# EAGLE design nixie_clock (EAGLE 7.2.0)
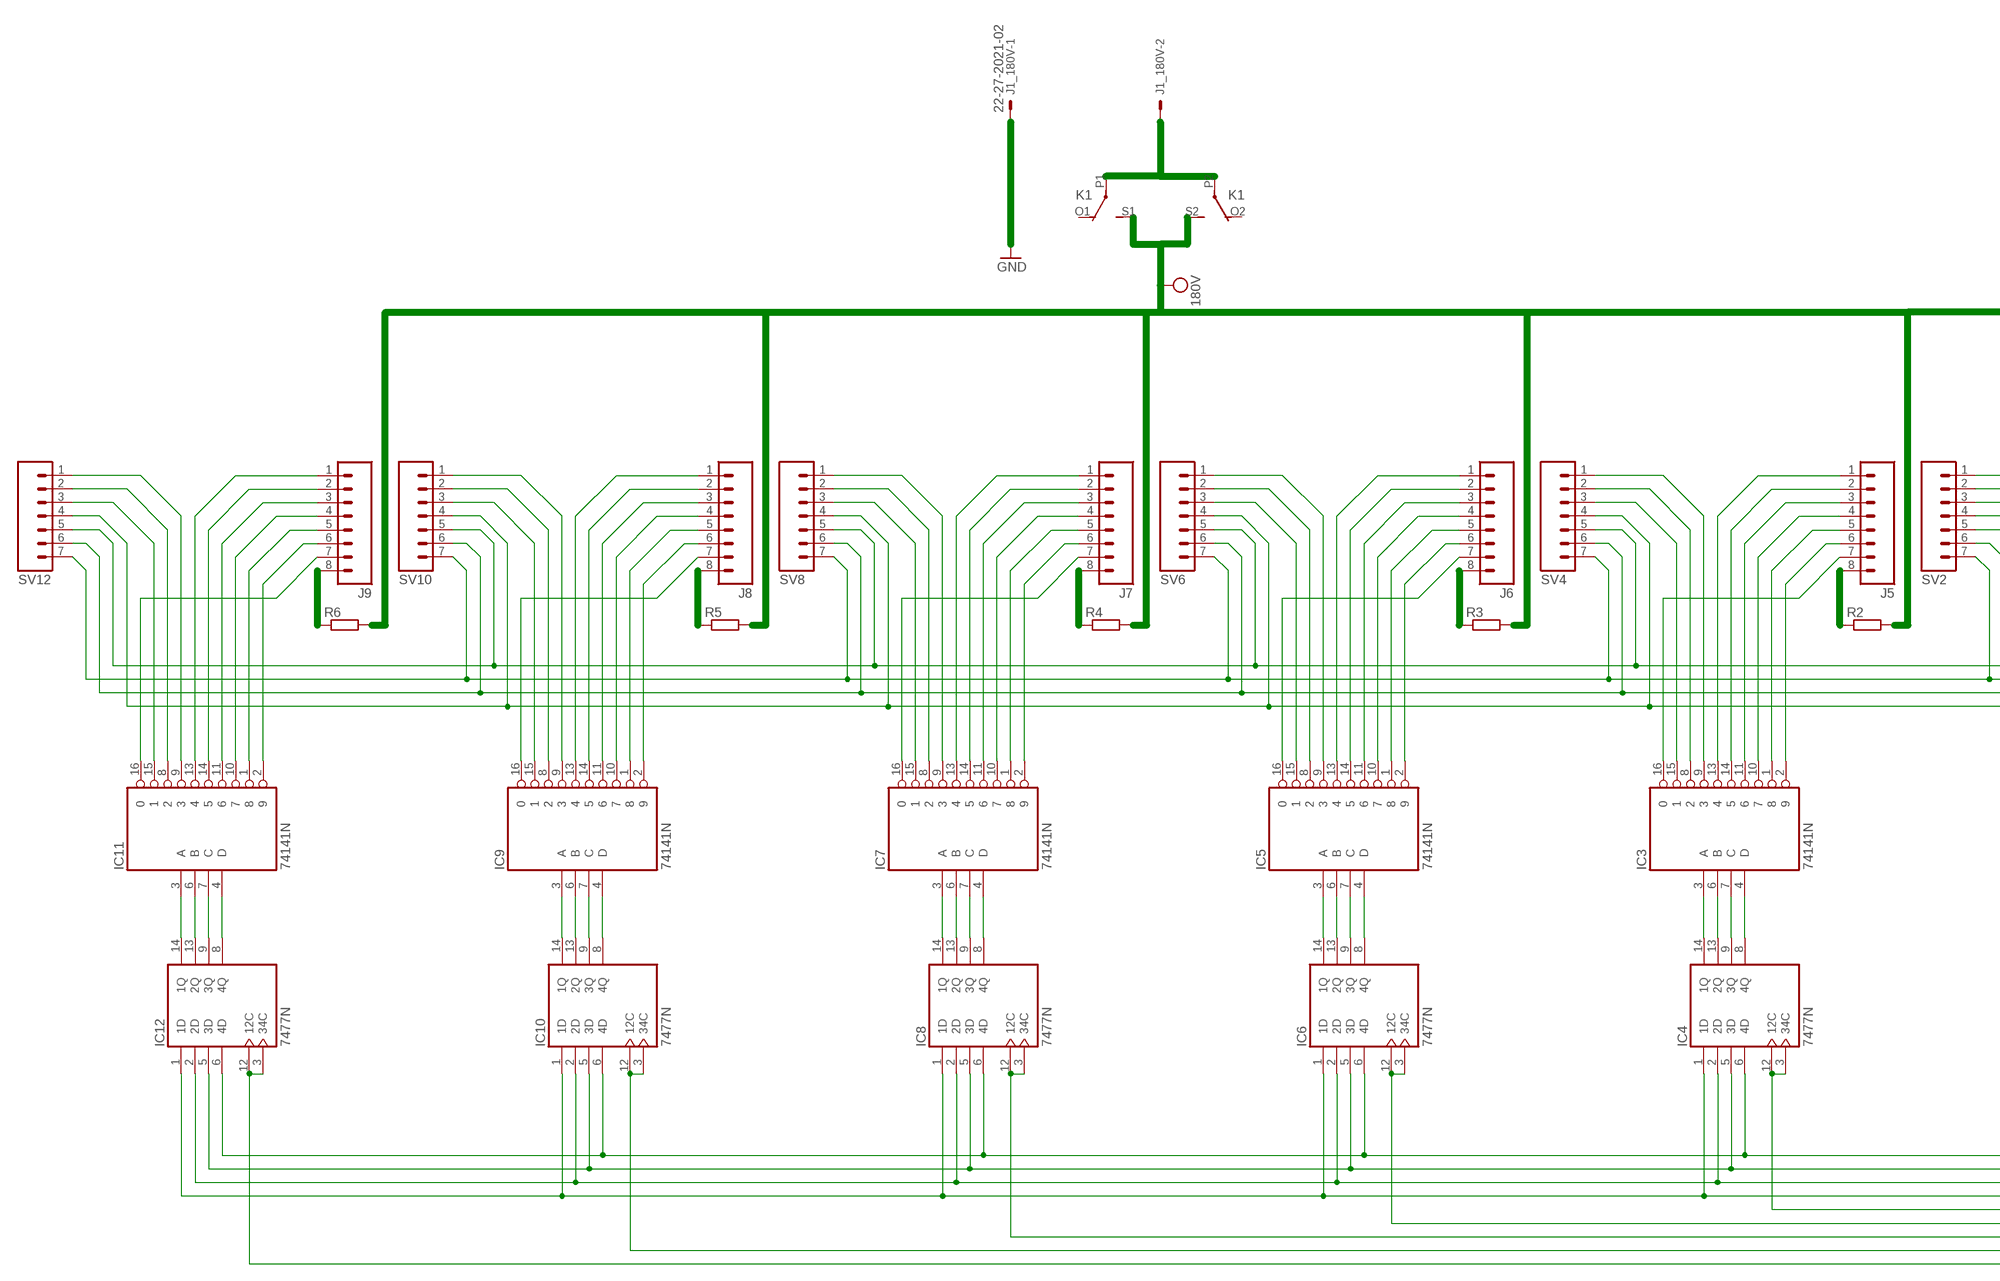
[diagram p0: schematic, sheet 1, part 1 of 3]
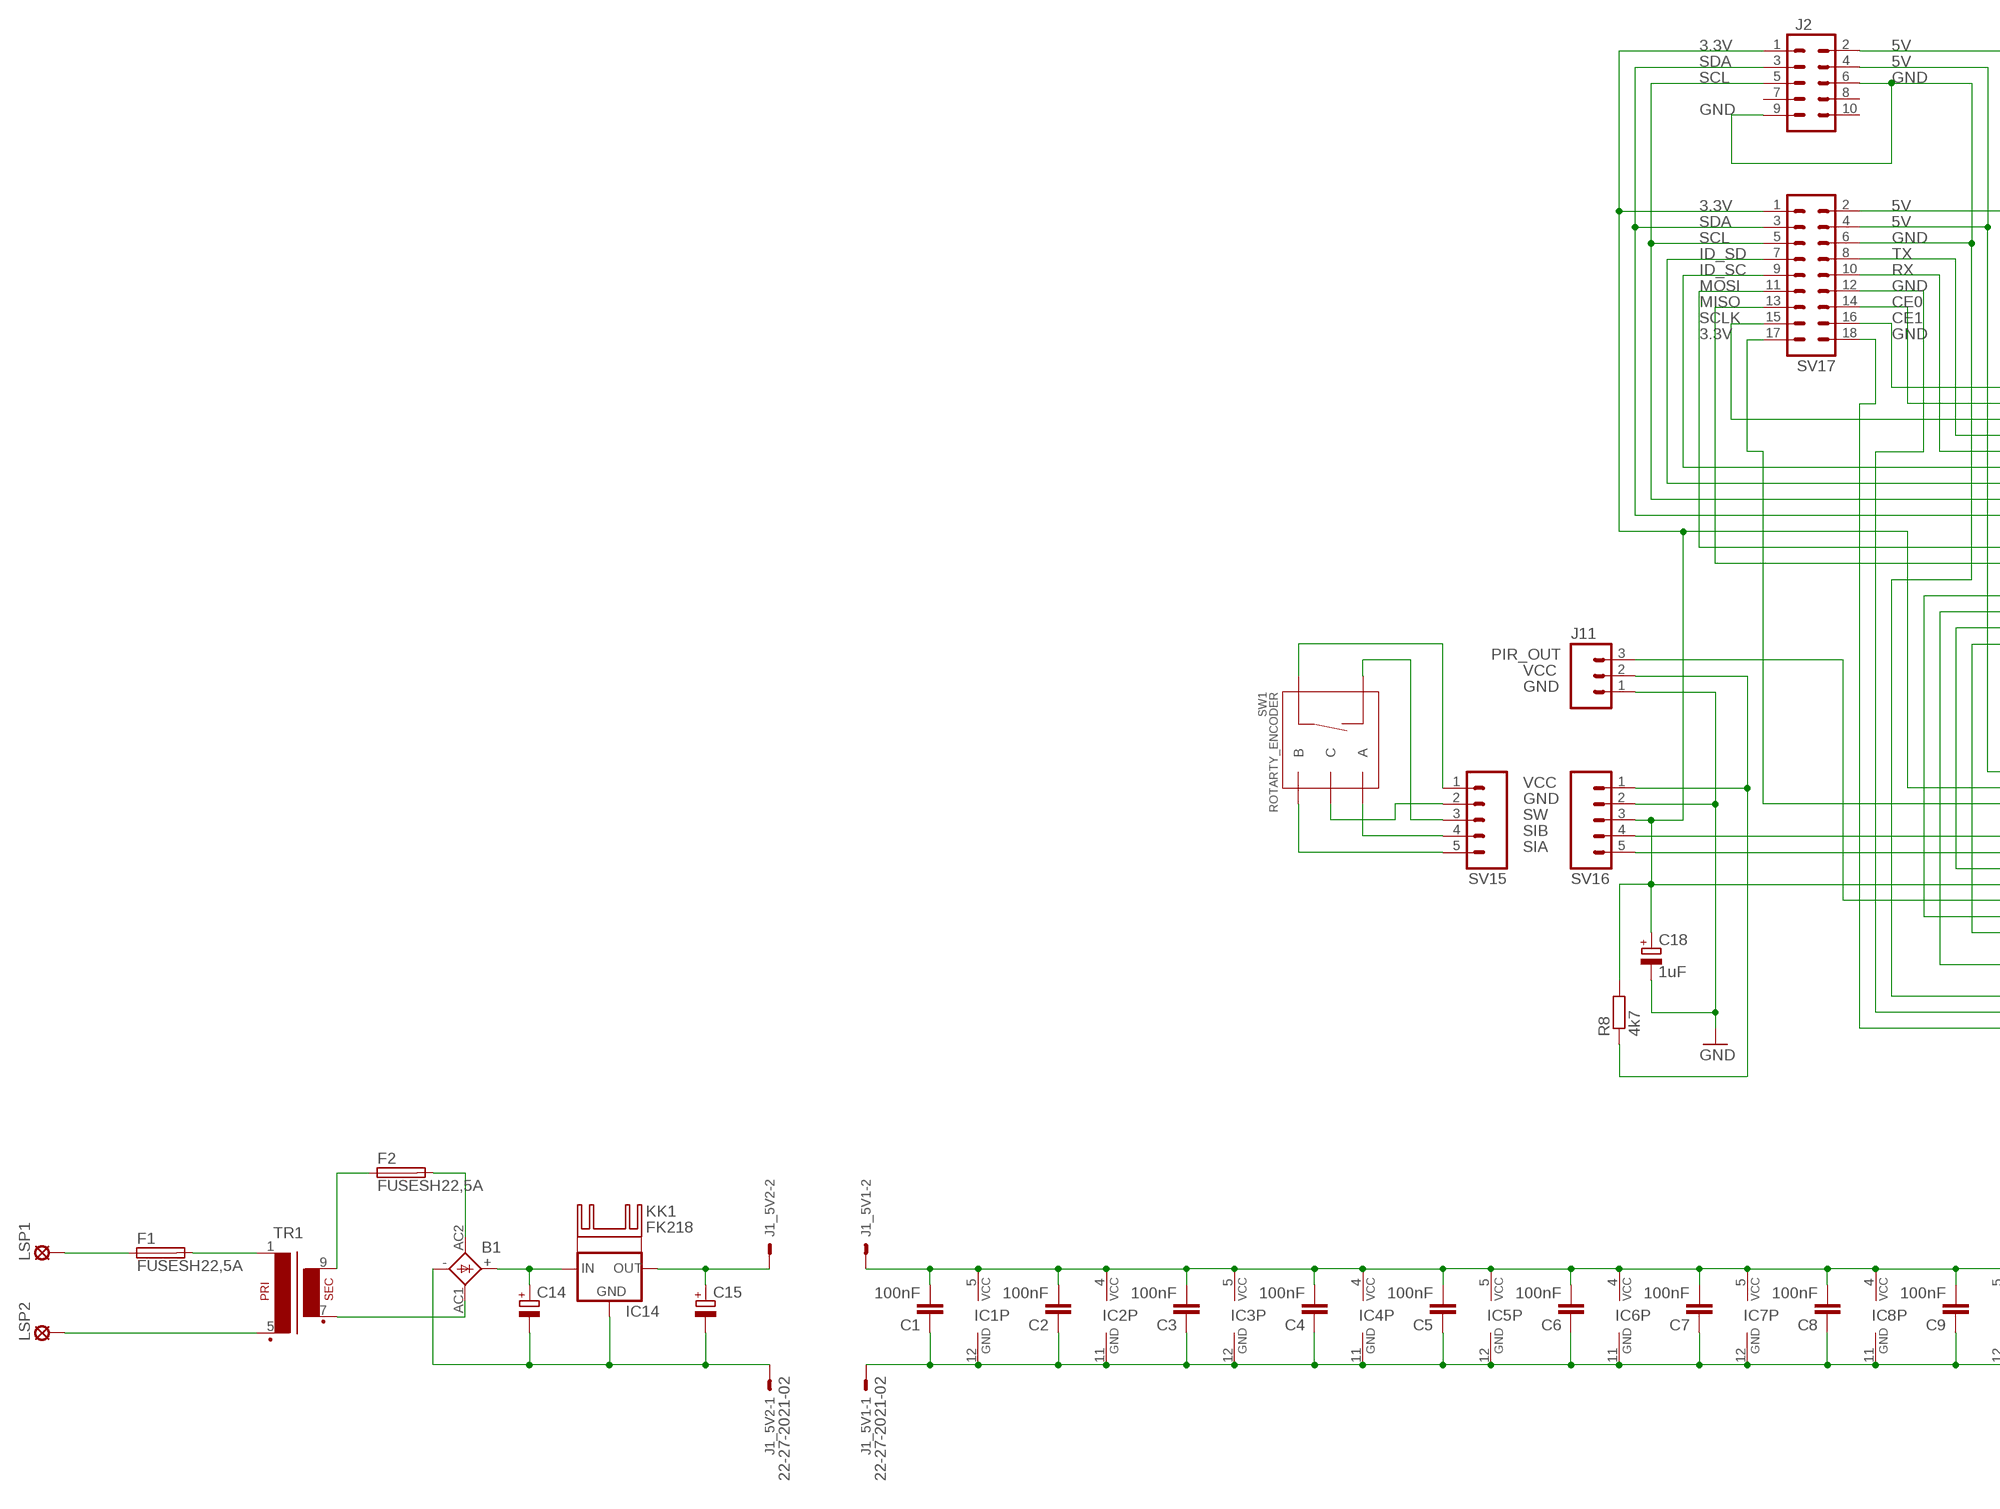
[diagram p1: schematic, sheet 1, part 2 of 3]
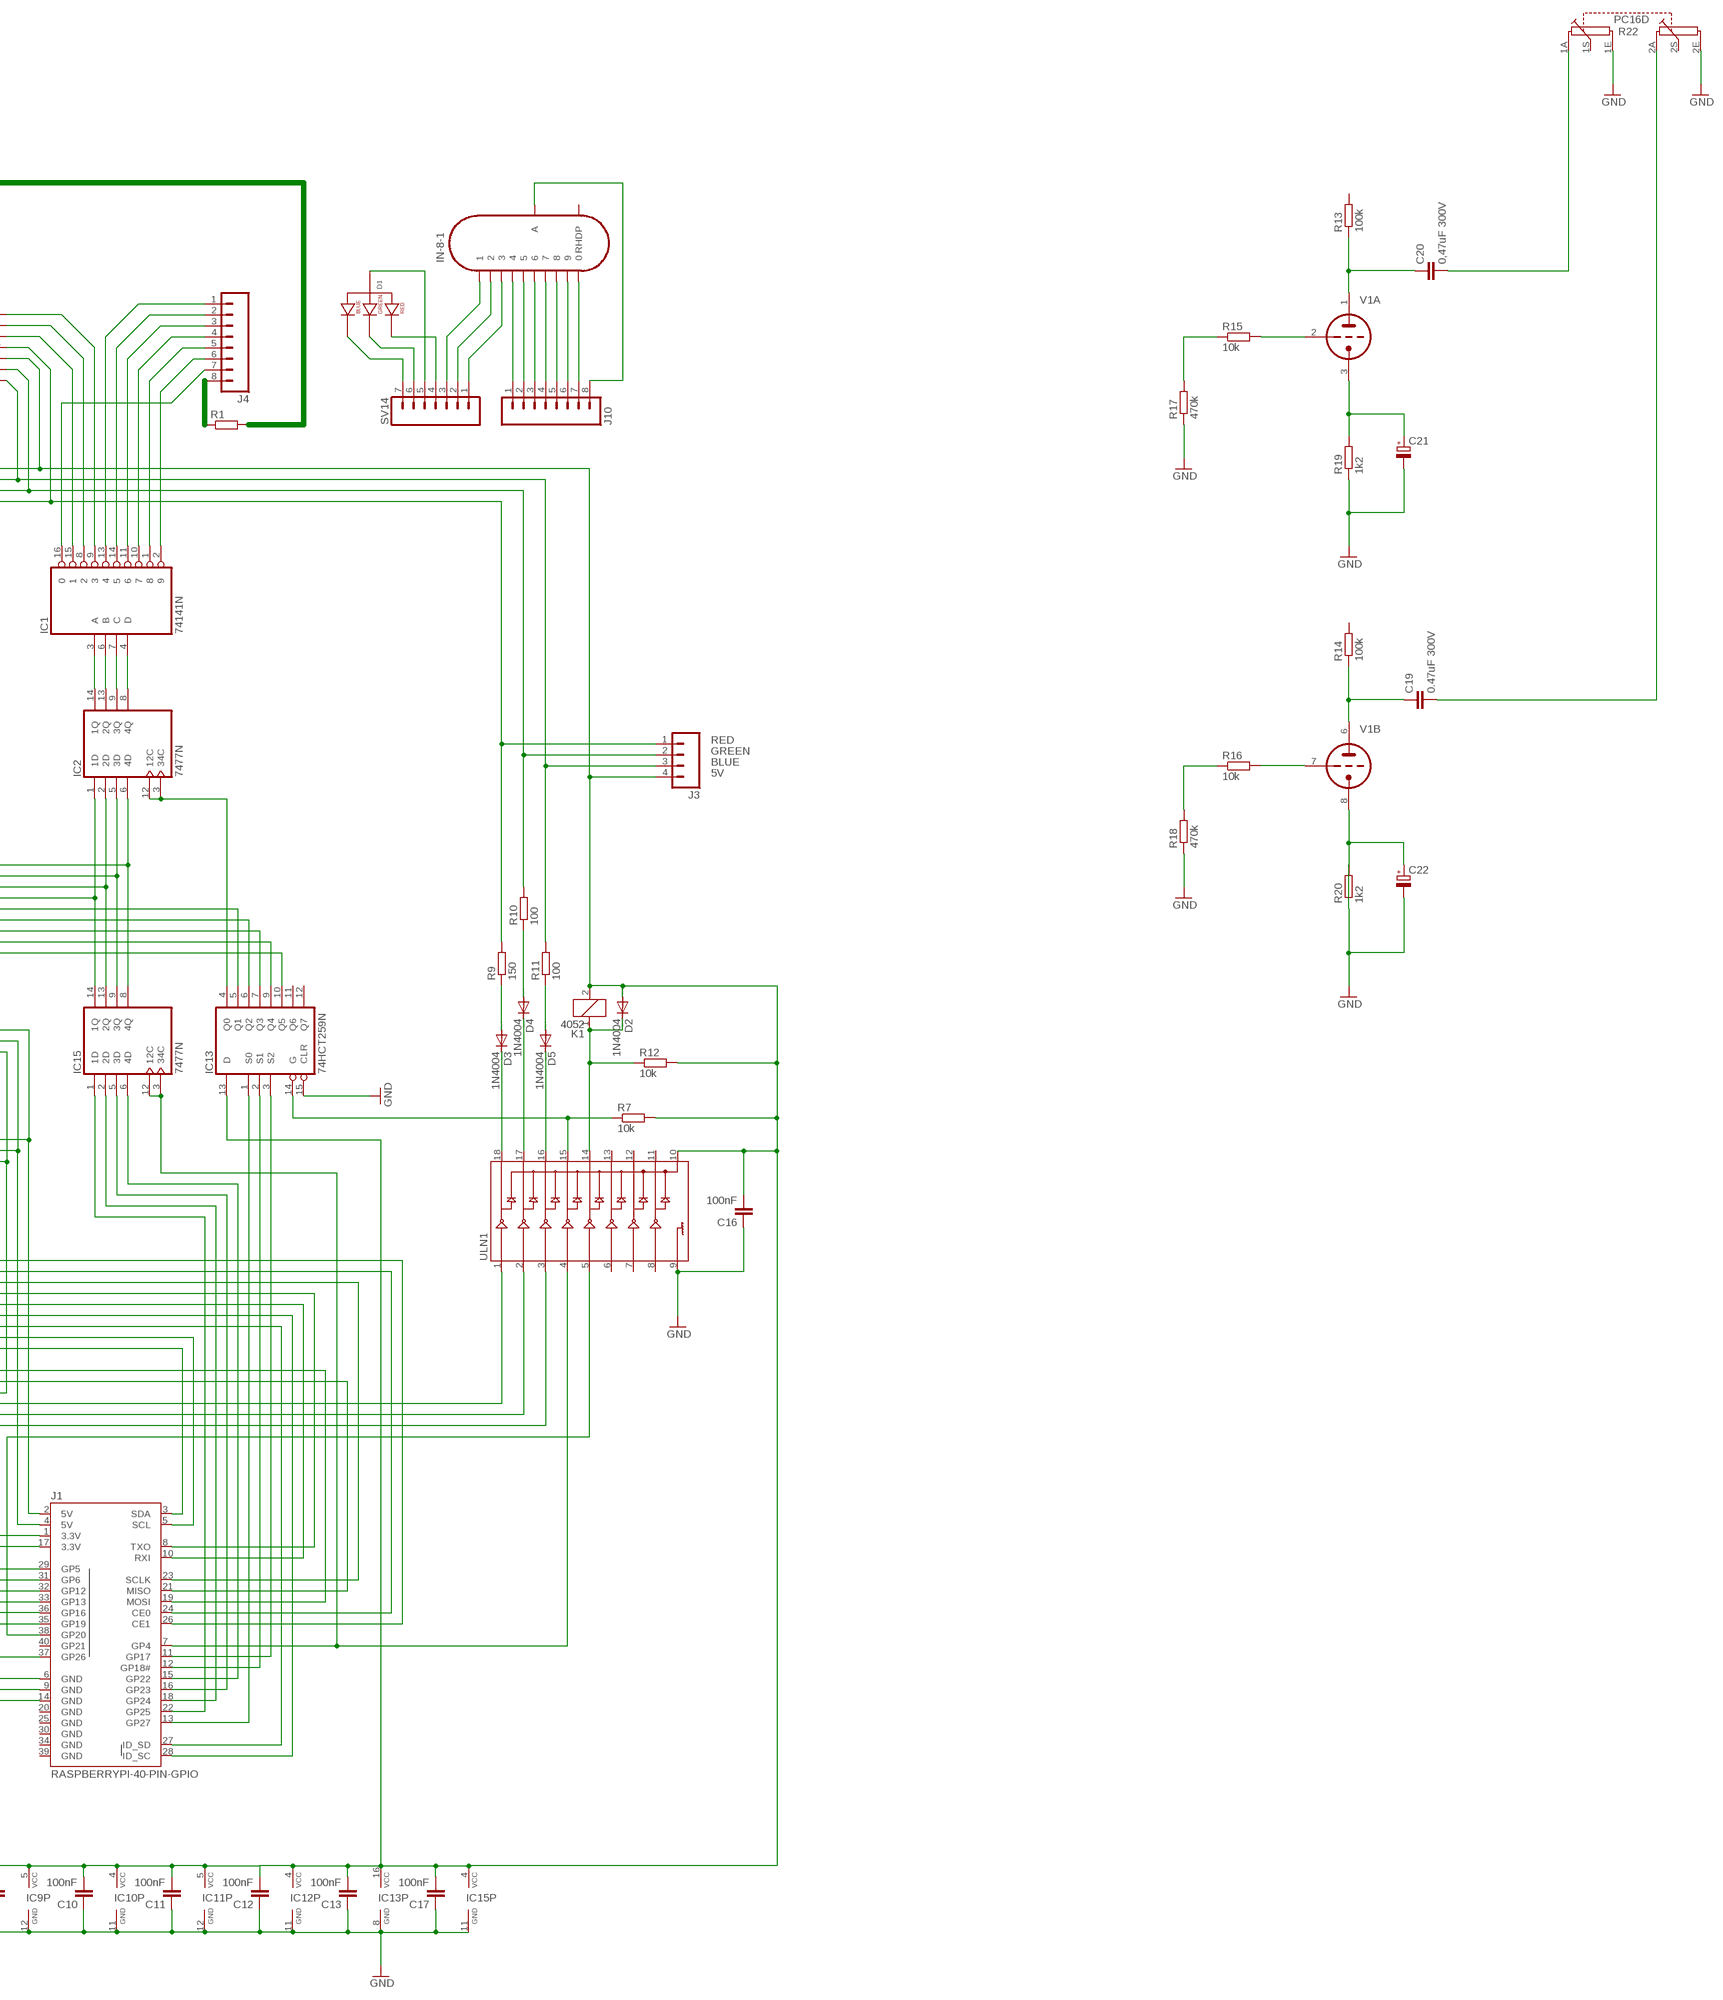
[diagram p2: schematic, sheet 1, part 3 of 3]

## Parts
B1  FBP1,5  [FBP1,5]
C1  100nF  C-EU025-024X044  [C025-024X044]
C2  100nF  C-EU025-024X044  [C025-024X044]
C3  100nF  C-EU025-024X044  [C025-024X044]
C4  100nF  C-EU025-024X044  [C025-024X044]
C5  100nF  C-EU025-024X044  [C025-024X044]
C6  100nF  C-EU025-024X044  [C025-024X044]
C7  100nF  C-EU025-024X044  [C025-024X044]
C8  100nF  C-EU025-024X044  [C025-024X044]
C9  100nF  C-EU025-024X044  [C025-024X044]
C10  100nF  C-EU025-024X044  [C025-024X044]
C11  100nF  C-EU025-024X044  [C025-024X044]
C12  100nF  C-EU025-024X044  [C025-024X044]
C13  100nF  C-EU025-024X044  [C025-024X044]
C14  CPOL-EUE5-10.5  [E5-10,5]
C15  CPOL-EUE3.5-10  [E3,5-10]
C16  100nF  C-EU025-024X044  [C025-024X044]
C17  100nF  C-EU025-024X044  [C025-024X044]
C18  1uF  CPOL-EUE2.5-5  [E2,5-5]
C19  0.47uF 300V  C-EU275-154X316  [C275-154X316]
C20  0,47uF 300V  C-EU275-154X316  [C275-154X316]
C21  CPOL-EUE2.5-5  [E2,5-5]
C22  CPOL-EUE2.5-5  [E2,5-5]
D1  LED-RGB-CA-THRUCLEAR  [LED-RGB-THRU]
D2  1N4004  [DO41-10]
D3  1N4004  [DO41-10]
D4  1N4004  [DO41-10]
D5  1N4004  [DO41-10]
F1  FUSESH22,5A  [SH22,5A]
F2  FUSESH22,5A  [SH22,5A]
IC1  74141N  [DIL16]
IC2  7477N  [DIL14]
IC3  74141N  [DIL16]
IC4  7477N  [DIL14]
IC5  74141N  [DIL16]
IC6  7477N  [DIL14]
IC7  74141N  [DIL16]
IC8  7477N  [DIL14]
IC9  74141N  [DIL16]
IC10  7477N  [DIL14]
IC11  74141N  [DIL16]
IC12  7477N  [DIL14]
IC13  74HCT259N  [DIL16]
IC14  78XXS  [78XXS]
IC15  7477N  [DIL14]
IN-8-1  IN-8-2  [IN-8-2]
J1  RASPBERRYPI-40-PIN-GPIO  [2X20-SHROUDED]
J1_5V1  22-27-2021-02  [6410-02]
J1_5V2  22-27-2021-02  [6410-02]
J1_180V  22-27-2021-02  [6410-02]
J2  M05X2PTH  [AVR_ICSP]
J3  M04  [04P]
J4  M08  [1X08_ROUND]
J5  M08  [1X08_ROUND]
J6  M08  [1X08_ROUND]
J7  M08  [1X08_ROUND]
J8  M08  [1X08_ROUND]
J9  M08  [1X08_ROUND]
J10  M08  [1X08_ROUND]
J11  M03  [03P]
K1  4052  [F4052]
KK1  FK218  [FK218]
LSP1  LSP10  [LSP10]
LSP2  LSP10  [LSP10]
R1  R-EU_0207/15  [0207/15]
R2  R-EU_0207/15  [0207/15]
R3  R-EU_0207/15  [0207/15]
R4  R-EU_0207/15  [0207/15]
R5  R-EU_0207/15  [0207/15]
R6  R-EU_0207/15  [0207/15]
R7  10k  R-EU_0204/7  [0204/7]
R8  4k7  R-EU_0204/7  [0204/7]
R9  150  R-EU_0204/7  [0204/7]
R10  100  R-EU_0204/7  [0204/7]
R11  100  R-EU_0204/7  [0204/7]
R12  10k  R-EU_0204/7  [0204/7]
R13  100k  R-EU_0309/10  [0309/10]
R14  100k  R-EU_0309/10  [0309/10]
R15  10k  R-EU_0309/10  [0309/10]
R16  10k  R-EU_0309/10  [0309/10]
R17  470k  R-EU_0309/10  [0309/10]
R18  470k  R-EU_0309/10  [0309/10]
R19  1k2  R-EU_0309/10  [0309/10]
R20  1k2  R-EU_0309/10  [0309/10]
R22  PC16D  [PC16D]
SV2  M07  [1X07]
SV4  M07  [1X07]
SV6  M07  [1X07]
SV8  M07  [1X07]
SV10  M07  [1X07]
SV12  M07  [1X07]
SV14  M07  [1X07]
SV15  M05PTH  [1X05]
SV16  M05  [05P]
SV17  MA09-2  [MA09-2]
SW1  ROTARTY_ENCODER  [ROTARY_ENC_PLAIN]
TR1  EI42-1  [EI42-1]
ULN1  ULN2803DIP  [DIL18]
V1  ECC82-P  [NOVAL]

## Nets
5V [180V]: C1.2 C2.2 C3.2 C4.2 C5.2 C6.2 C7.2 C8.2 C9.2 C10.2 C11.2 C12.2 C13.2 C16.2 C17.2 D2.A IC1.5(VCC) IC2.4(VCC) IC3.5(VCC) IC4.4(VCC) IC5.5(VCC) IC6.4(VCC) IC7.5(VCC) IC8.4(VCC) IC9.5(VCC) IC10.4(VCC) IC11.5(VCC) IC12.4(VCC) IC13.13(D) IC13.16(VCC) IC15.4(VCC) J1_5V1.2 J3.4 K1.2 R7.2 R12.2 SV2.5 SV4.5 SV6.5 SV8.5 SV10.5 SV12.5 ULN1.10
BLUE: J3.3 R11.2 SV2.7 SV4.7 SV6.7 SV8.7 SV10.7 SV12.7
GND [180V]: C1.1 C2.1 C3.1 C4.1 C5.1 C6.1 C7.1 C8.1 C9.1 C10.1 C11.1 C12.1 C13.1 C16.1 C17.1 C18.- C21.- IC1.12(GND) IC2.11(GND) IC3.12(GND) IC4.11(GND) IC5.12(GND) IC6.11(GND) IC7.12(GND) IC8.11(GND) IC9.12(GND) IC10.11(GND) IC11.12(GND) IC12.11(GND) IC13.8(GND) IC13.15(CLR) IC15.11(GND) J1_5V1.1 J1_180V.1 J11.1 R17.1 R18.1 R19.1 R22.1E R22.2E SV16.2 ULN1.9
GREEN: J3.2 R10.2 SV2.6 SV4.6 SV6.6 SV8.6 SV10.6 SV12.6
N$1: IN-8-1.4 J10.1
N$2: IC1.3(A) IC2.14(1Q)
N$3: IC1.6(B) IC2.13(2Q)
N$4: IC1.7(C) IC2.9(3Q)
N$5: IC1.4(D) IC2.8(4Q)
N$6: IN-8-1.5 J10.2
N$7: IN-8-1.6 J10.3
N$8: IN-8-1.7 J10.4
N$9: IN-8-1.8 J10.5
N$10: IN-8-1.9 J10.6
N$11: IN-8-1.0 J10.7
N$12: IN-8-1.3 SV14.1
N$13: IN-8-1.2 SV14.2
N$14: IN-8-1.1 SV14.3
N$15: D1.1(RED_CATHODE) SV14.4
N$16: IC2.3(34C) IC2.12(12C) IC13.4(Q0)
N$17: IC2.6(4D) IC4.6(4D) IC6.6(4D) IC8.6(4D) IC10.6(4D) IC12.6(4D) IC15.8(4Q)
N$18: IC1.13 J4.1
N$19: IC1.14 J4.2
N$20: D1.4(BLUE_CATHODE) SV14.7
N$21: D1.2(ANODE) SV14.5
N$22: D1.3(GREEN_CATHODE) SV14.6
N$23: IC1.11 J4.3
N$24: IC1.10 J4.4
N$25: IC1.1 J4.5
N$26: IC1.2 J4.6
N$27: IC1.9 SV2.1
N$28: IC1.8 SV2.2
N$29: IC3.3(A) IC4.14(1Q)
N$30: IC3.6(B) IC4.13(2Q)
N$31: IC3.7(C) IC4.9(3Q)
N$32: IC3.4(D) IC4.8(4Q)
N$33: IC4.3(34C) IC4.12(12C) IC13.5(Q1)
N$34: IC1.15 SV2.3
N$35: IC1.16 J4.7
N$36: IC3.13 J5.1
N$37: IC3.14 J5.2
N$38: IC3.11 J5.3
N$39: IC3.10 J5.4
N$40: IC3.1 J5.5
N$41: IC3.2 J5.6
N$42: IC3.16 J5.7
N$43: IC3.9 SV4.1
N$44: IC5.3(A) IC6.14(1Q)
N$45: IC5.6(B) IC6.13(2Q)
N$46: IC5.7(C) IC6.9(3Q)
N$47: IC5.4(D) IC6.8(4Q)
N$48: IC6.3(34C) IC6.12(12C) IC13.6(Q2)
N$49: IC3.8 SV4.2
N$50: IC3.15 SV4.3
N$51: IC5.13 J6.1
N$52: IC5.14 J6.2
N$53: IC5.11 J6.3
N$54: IC5.10 J6.4
N$55: IC5.1 J6.5
N$56: IC5.2 J6.6
N$57: IC5.16 J6.7
N$58: IC5.9 SV6.1
N$59: IC7.3(A) IC8.14(1Q)
N$60: IC7.6(B) IC8.13(2Q)
N$61: IC7.7(C) IC8.9(3Q)
N$62: IC7.4(D) IC8.8(4Q)
N$63: IC8.3(34C) IC8.12(12C) IC13.7(Q3)
N$64: IC5.8 SV6.2
N$65: IC5.15 SV6.3
N$66: IC7.13 J7.1
N$67: IC7.14 J7.2
N$68: IC7.11 J7.3
N$69: IC7.10 J7.4
N$70: IC7.1 J7.5
N$71: IC7.2 J7.6
N$72: IC7.16 J7.7
N$73: IC7.9 SV8.1
N$74: IC9.3(A) IC10.14(1Q)
N$75: IC9.6(B) IC10.13(2Q)
N$76: IC9.7(C) IC10.9(3Q)
N$77: IC9.4(D) IC10.8(4Q)
N$78: IC10.3(34C) IC10.12(12C) IC13.9(Q4)
N$79: IC7.8 SV8.2
N$80: IC7.15 SV8.3
N$81: IC9.13 J8.1
N$82: IC9.14 J8.2
N$83: IC9.11 J8.3
N$84: IC9.10 J8.4
N$85: IC9.1 J8.5
N$86: IC9.2 J8.6
N$87: IC11.13 J9.1
N$88: IC11.14 J9.2
N$89: IC11.3(A) IC12.14(1Q)
N$90: IC11.6(B) IC12.13(2Q)
N$91: IC11.7(C) IC12.9(3Q)
N$92: IC11.4(D) IC12.8(4Q)
N$93: IC12.3(34C) IC12.12(12C) IC13.10(Q5)
N$94: IC2.5(3D) IC4.5(3D) IC6.5(3D) IC8.5(3D) IC10.5(3D) IC12.5(3D) IC15.9(3Q)
N$95: IC2.2(2D) IC4.2(2D) IC6.2(2D) IC8.2(2D) IC10.2(2D) IC12.2(2D) IC15.13(2Q)
N$96: IC2.1(1D) IC4.1(1D) IC6.1(1D) IC8.1(1D) IC10.1(1D) IC12.1(1D) IC15.14(1Q)
N$97: IC13.1(S0) J1.13(GP27)
N$98: IC13.2(S1) J1.12(GP18#)
N$99: IC13.3(S2) J1.11(GP17)
N$100: IC9.16 J8.7
N$101: IC9.9 SV10.1
N$102: IC9.8 SV10.2
N$103: IC9.15 SV10.3
N$104: IN-8-1.A J10.8
N$105: IC11.11 J9.3
N$106: IC11.10 J9.4
N$107: IC11.1 J9.5
N$108: B1.+ C14.+ IC14.IN
N$109: IC11.2 J9.6
N$110: IC11.16 J9.7
N$111: IC11.9 SV12.1
N$112: IC11.8 SV12.2
N$113: IC11.15 SV12.3
N$114 [180V]: J8.8 R5.1
N$115 [180V]: J9.8 R6.1
N$116: D4.C ULN1.17
N$117: F1.1 LSP1.MP
N$118: F1.2 TR1.1
N$119: LSP2.MP TR1.5(P2)
N$120: F2.1 TR1.9(S4)
N$121: B1.AC2(AC1) F2.2
N$122: B1.AC1(AC2) TR1.7(S3)
N$123: C15.+ IC14.OUT J1_5V2.2
N$124: J1.35(GP19) ULN1.1
N$125 [180V]: B1.- C14.- C15.- IC14.GND J1_5V2.1
N$126 [180V]: J1_180V.2 K1.P1(2:P) K1.P2(3:P)
N$127: J1.37(GP26) ULN1.2
N$128: SV15.4 SW1.A
N$129: J1.32(GP12) ULN1.3
N$130: C18.+ J1.1(3.3V) J1.33(GP13) J2.1 R8.2 SV16.3 SV17.1
N$131: SV15.3 SW1.SW-
N$132: SV15.1 SW1.SW+
N$133: SV15.2 SW1.C
N$134: SV15.5 SW1.B
N$135: D3.C ULN1.18
N$136: D5.C ULN1.16
N$137: J1.31(GP6) SV16.5
N$138: J1.29(GP5) SV16.4
N$139: D3.A R9.1
N$140: IC13.14(G) R7.1 ULN1.15
N$141: IC15.1(1D) J1.22(GP25)
N$142: IC15.2(2D) J1.18(GP24)
N$143: IC15.5(3D) J1.16(GP23)
N$144: IC15.6(4D) J1.15(GP22)
N$146: IC15.3(34C) IC15.12(12C) J1.7(GP4) ULN1.4
N$147: D4.A R10.1
N$148: D5.A R11.1
N$149: J1.38(GP20) ULN1.5
N$150 [180V]: J7.8 R4.1
N$151: D2.C K1.1 R12.1 ULN1.14
N$152: J1.17(3.3V) SV17.17
N$153: J1.4(5V) J2.4 SV17.4
N$154: J1.3(SDA) J2.3 SV17.3
N$155: J1.5(SCL) J2.5 SV17.5
N$156: J1.6(GND) J2.6 J2.9 SV17.6
N$157: J1.27(ID_SD) SV17.7
N$158: J1.28(ID_SC) SV17.9
N$159: J1.8(TXO) SV17.8
N$160: J1.10(RXI) SV17.10
N$161: J1.19(MOSI) SV17.11
N$162: J1.21(MISO) SV17.13
N$163: J1.23(SCLK) SV17.15
N$164 [180V]: J4.8 R1.1
N$165: J1.9(GND) SV17.12
N$166: J1.24(CE0) SV17.14
N$167: J1.26(CE1) SV17.16
N$168: J1.14(GND) SV17.18
N$169 [180V]: J6.8 R3.1
N$170 [180V]: R1.2 R2.2 R3.2 R4.2 R5.2 R6.2
N$171 [180V]: J5.8 R2.1
N$172: J1.2(5V) J2.2 SV17.2
N$173: J1.36(GP16) J11.3
N$174: R15.1 R17.2
N$175: R16.1 R18.2
N$176: R15.2 V1.2(A:TG)
N$177: C20.1 R13.1 V1.1(A:TA)
N$178: C19.1 R14.1 V1.6(B:TA)
N$179: R16.2 V1.7(B:TG)
N$180: C22.+ C22.- R20.1 R20.2 V1.8(B:TK) ; supply symbol labelled GND
N$181: C21.+ R19.2 V1.3(A:TK)
N$182 [180V]: J11.2 R8.1 SV16.1
N$184: C20.2 R22.1A
N$185: C19.2 R22.2A
RED: J3.1 R9.2 SV2.4 SV4.4 SV6.4 SV8.4 SV10.4 SV12.4
VCC [180V]: K1.S1(2:S) K1.S2(3:S) ; supply symbol labelled 180V
Unconnected: IC13.11(Q6) IC13.12(Q7) IN-8-1..(RHDP) J1.40(GP21) J2.7 J2.8 J2.10 K1.O1(2:O) K1.O2(3:O) KK1.A2,2(K) KK1.B2,2(K) R13.2 R14.2 R22.1S R22.2S ULN1.6 ULN1.7 ULN1.8 ULN1.11 ULN1.12 ULN1.13 V1.4(":H1) V1.5(":H3) V1.9(":H2)

## Notes on the sheet
- 3.3V | 5V
- SDA | 5V
- SCL | GND
- GND
- 3.3V | 5V
- SDA | 5V
- SCL | GND
- ID_SD | TX
- ID_SC | RX
- MOSI | GND
- MISO | CE0
- SCLK | CE1
- 3.3V | GND
- PIR_OUT
- VCC
- GND
- VCC
- GND
- SW
- SIB
- SIA

## Power pins joined to a net without a drawn wire
GND: J1.20(GND) J1.25(GND) J1.30(GND) J1.34(GND) J1.39(GND)

## Library data of the parts
B1 = rectifier:FBP1,5: FAGOR RECTIFIER grid 3 x 4 mm
C1-C13 C16 C17 = resistor:C-EU: CAPACITOR, European symbol; MF: MULTICOMP; MPN: MCFYU6104Z6; OC_FARNELL: 9411887
C14 C15 C18 = rcl:CPOL-EU: POLARIZED CAPACITOR, European symbol
C19 C20 = resistor:C-EU: CAPACITOR, European symbol
C21 C22 = resistor:CPOL-EU: POLARIZED CAPACITOR, European symbol
D1 = SparkFun-LED:LED-RGB-CA-THRU: RGB Through-hole common anode SparkFun store front COM-10821 (diffuse) COM-10820 (clear); PROD_ID: DIO-10631
D2-D5 = diode:1N4004: DIODE general purpose rectifier, 1 A
F1 F2 = fuse:FUSE: Fuse; OC_FARNELL: unknown; OC_NEWARK: unknown
IC1 IC3 IC5 IC7 IC9 IC11 = 74xx-eu:74*141: BCD to decimal DECODER/DRIVER; OC_FARNELL: unknown
IC2 IC4 IC6 IC8 IC10 IC12 IC15 = 74xx-eu:74*77: 4-bit D LATCH; OC_FARNELL: unknown
IC13 = 74xx-eu:74*259: 8-bit addressable LATCH
IC14 = v-reg:78XXS: VOLTAGE REGULATOR
IN-8-1 = russian-nixies:IN-8-2: IN-8-2: medium numeric frontview nixie tube; OC_FARNELL: unknown
J1 = SparkFun-Boards:RASPBERRYPI-40-PIN-GPIO: Second Generation Raspberry Pi GPIO Header 2x20 pin connector, as found on B, B+, A+ models.
J1_5V1 J1_5V2 J1_180V = con-molex:22-?-02: CONNECTOR wire to board 2.54 mm (.1 inch) pitch header; OC_FARNELL: unknown; OC_NEWARK: unknown
J2 = SparkFun-Connectors:M05X2: Header 5x2 Standard 10-pin dual row 0.1" header. Commonly used with AVR-ISP. Use with Spark Fun Electronics SKU: PRT-00778
J3 = con-amp-quick:M04: AMP QUICK CONNECTOR; OC_FARNELL: unknown; OC_NEWARK: unknown
J4-J10 = SparkFun-Connectors:M08: Header 8 Standard 8-pin 0.1" header. Use with straight break away headers (SKU : PRT-00116), right angle break away headers (PRT-00553), swiss pins (PRT-00743), machine pins (PRT-00117), and female headers (PRT-00115).; PROD_ID: CONN-08437
J11 = con-amp-quick:M03: AMP QUICK CONNECTOR; OC_FARNELL: unknown; OC_NEWARK: unknown
K1 = relay:4052: RELAY 2 x switch, Finder
KK1 = heatsink:FK218: HEATSINK manufacturer Fischer/distributor Buerklin
LSP1 LSP2 = solpad:LSP10: SOLDER PAD drill 1.0 mm, distributor Buerklin, 12H555
R1-R6 = resistor:R-EU_: RESISTOR, European symbol; MF: VISHAY; MPN: MMA02040E5101BB100; OC_FARNELL: 3086112
R7-R12 = rcl:R-EU_: RESISTOR, European symbol
R13-R20 = resistor:R-EU_: RESISTOR, European symbol
R22 = piher:PC16D: POTENTIOMETER tandem carbon potentiometer, 16 mm, S3ROH; OC_FARNELL: 4453049; OC_NEWARK: unknown
SV2 SV4 SV6 SV8 SV10 SV12 SV14 = SparkFun-Connectors:M07: Header 7 Standard 7-pin 0.1" header. Use with straight break away headers (SKU : PRT-00116), right angle break away headers (PRT-00553), swiss pins (PRT-00743), machine pins (PRT-00117), and female headers (PRT-00115). NOTES ON THE VARIANTS LOCK and LOCK_LONGPADS... This footprint was designed to help hold the alignment of a through-hole component (i.e. 7-pin header) while soldering it into place. You may notice that each hole has been shifted either up or down by 0.005 of an inch from it's more standard position (which is usually a perfectly straight line). This slight alteration caused the pins (the squares in the middle) to touch the edges of the holes. Because they are alternating, it causes a "brace" to hold the header in place. 0.005 has proven to be the perfect amount of "off-center" position when using our standard breakaway headers. Although looks a little odd when you look at the bare footprint, once you have a header in there, the alteration is very hard to notice. Also, if you push a header all the way into place, it is covered up entirely on the bottom side. This idea of altering the position of holes to aid alignment will be further integrated into the Sparkfun Library for other footprints. It can help hold any component with 3 or more connection pins.
SV15 = SparkFun-Connectors:M05: Header 5 Standard 5-pin 0.1" header. Use with straight break away headers (SKU : PRT-00116), right angle break away headers (PRT-00553), swiss pins (PRT-00743), machine pins (PRT-00117), and female headers (PRT-00115). Molex polarized connector foot print use with SKU : PRT-08230 with associated crimp pins and housings.
SV16 = con-amp-quick:M05: AMP QUICK CONNECTOR; OC_FARNELL: unknown; OC_NEWARK: unknown
SV17 = con-lstb:MA09-2: PIN HEADER; OC_FARNELL: unknown; OC_NEWARK: unknown
SW1 = SparkFun-Electromechanical:ROTARTY_ENCODER: Simple no LED rotary encoder Example: COM-09117
TR1 = trafo:EI42-1: TRANSFORMER 1 primary winding, 1 secondary winding ERA
ULN1 = SparkFun-PowerIC:ULN2803: Darlington Driver ULN2803 Darlington array. 500mA max per channel, 8-channel package. Spark Fun Electronics SKU : COM-00312
V1 = Tubes:ECC82-P

## Net classes
0 5V: width 0.406 mm
1 180V: width 1.27 mm

## Board
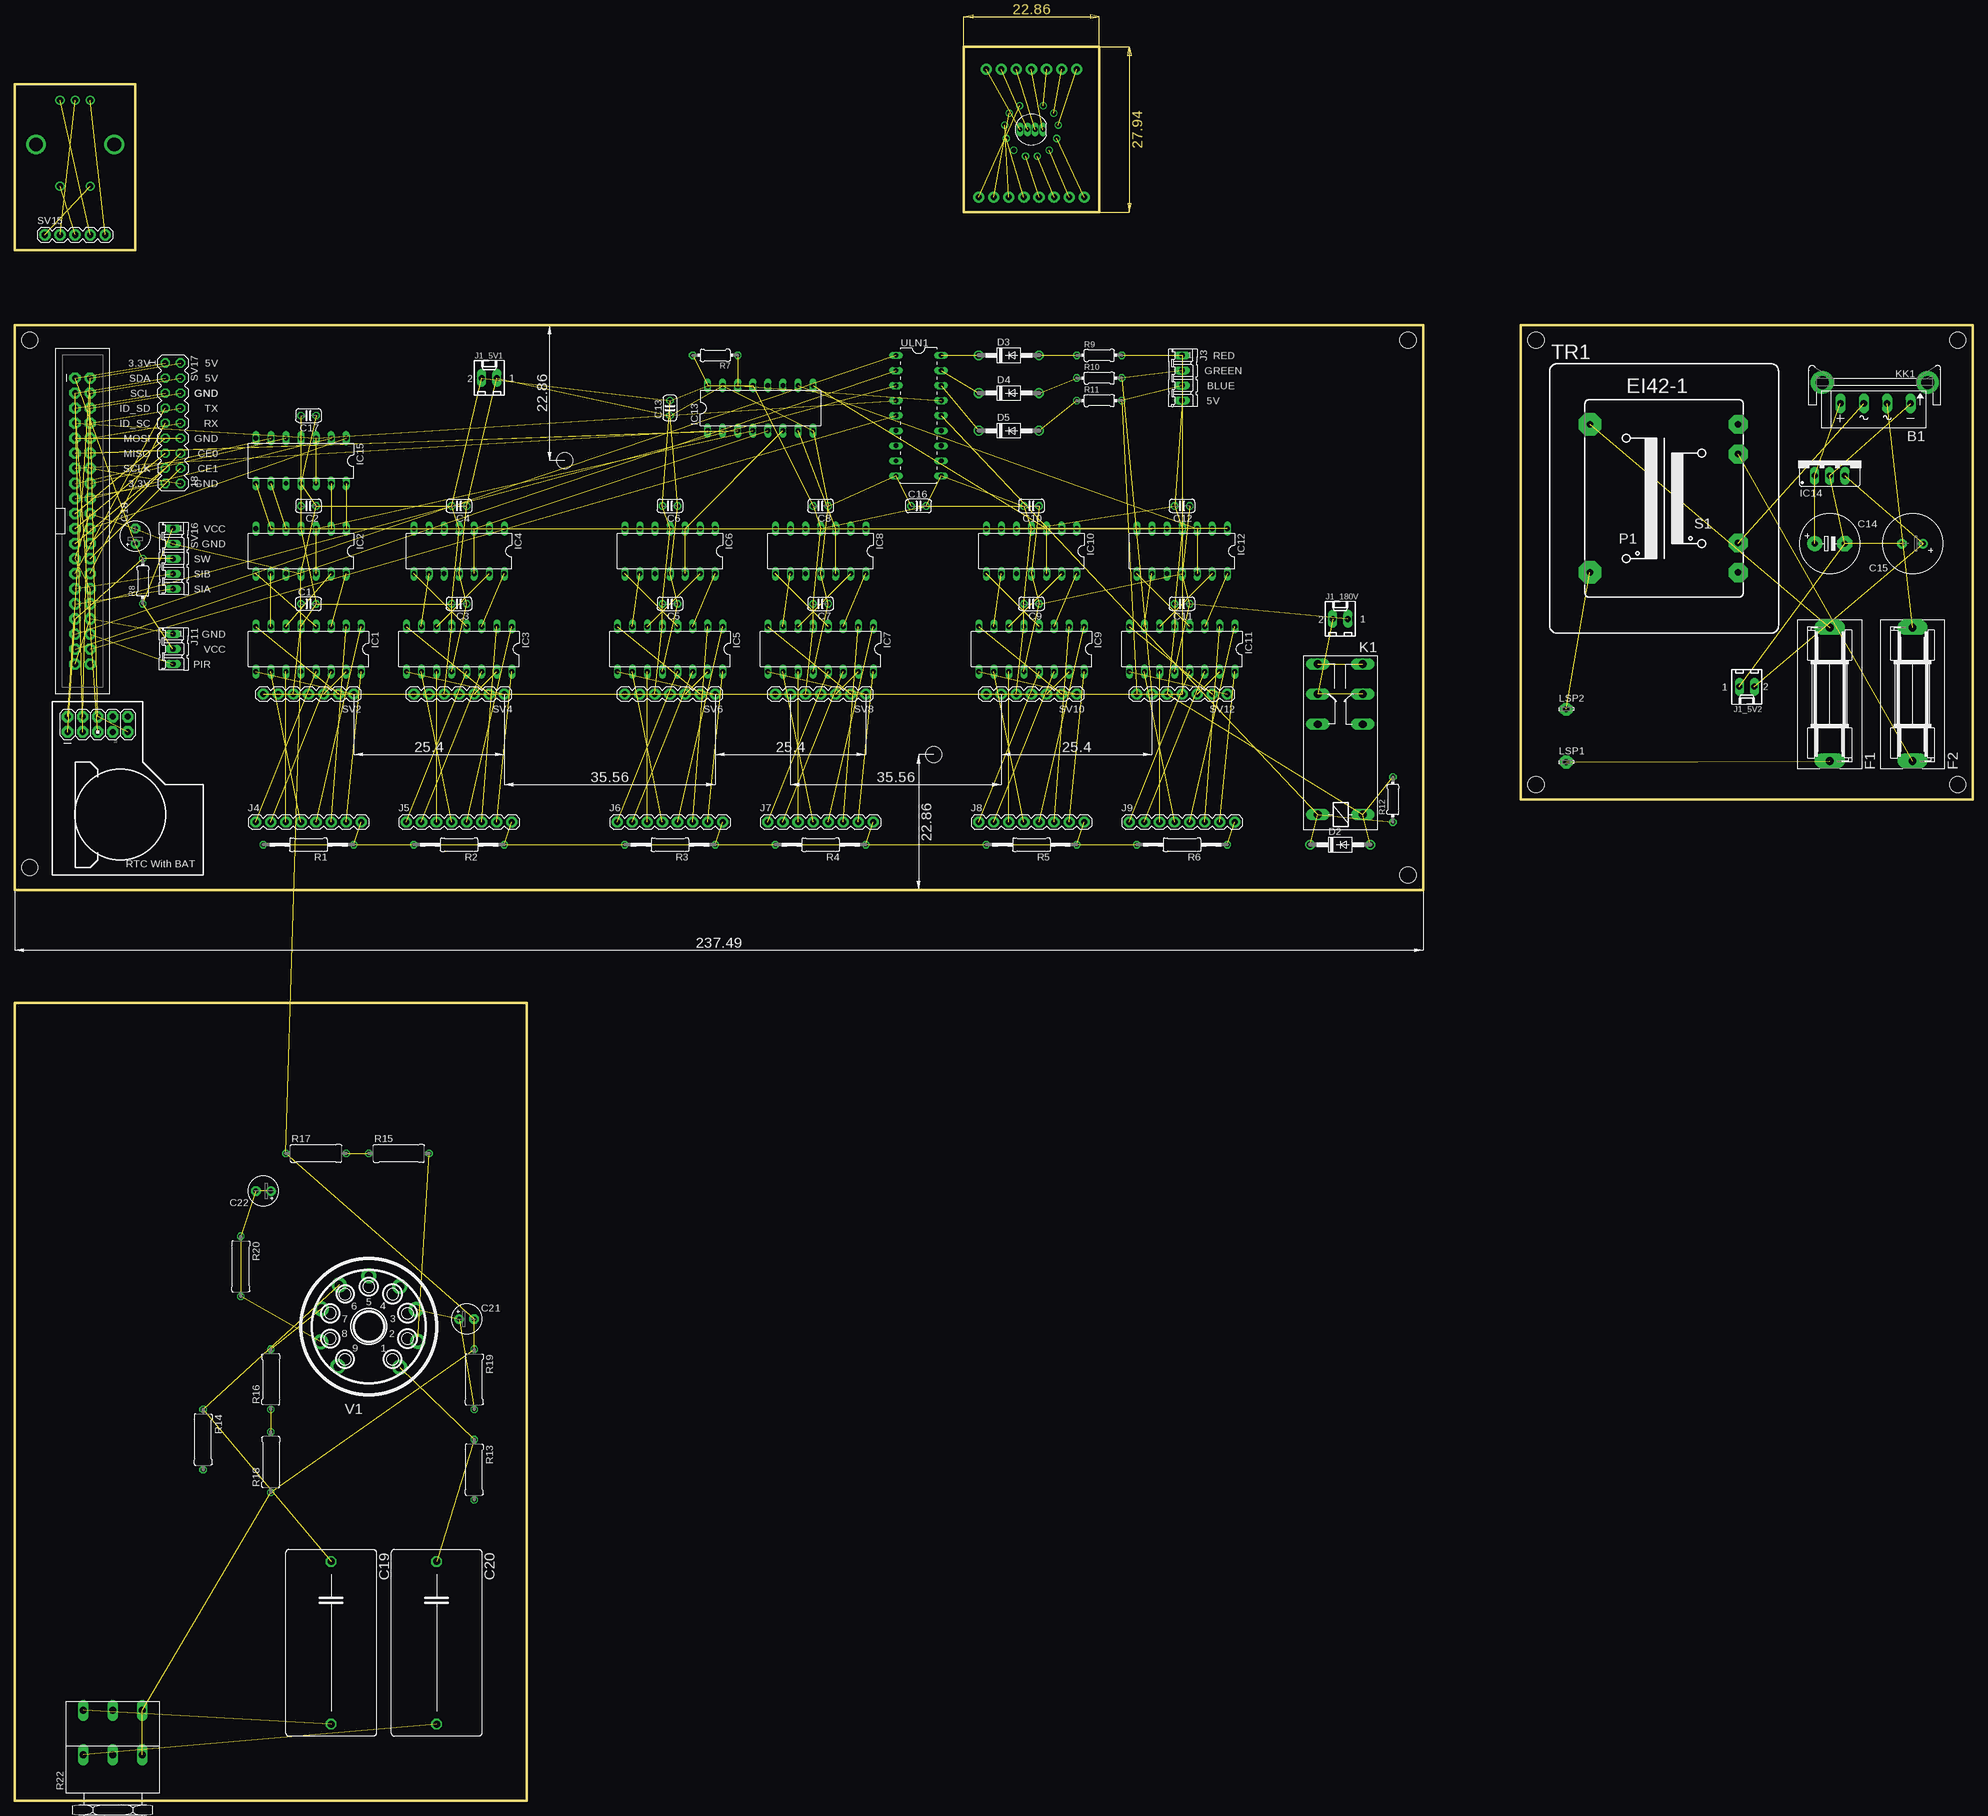
[diagram p3: board, top side]
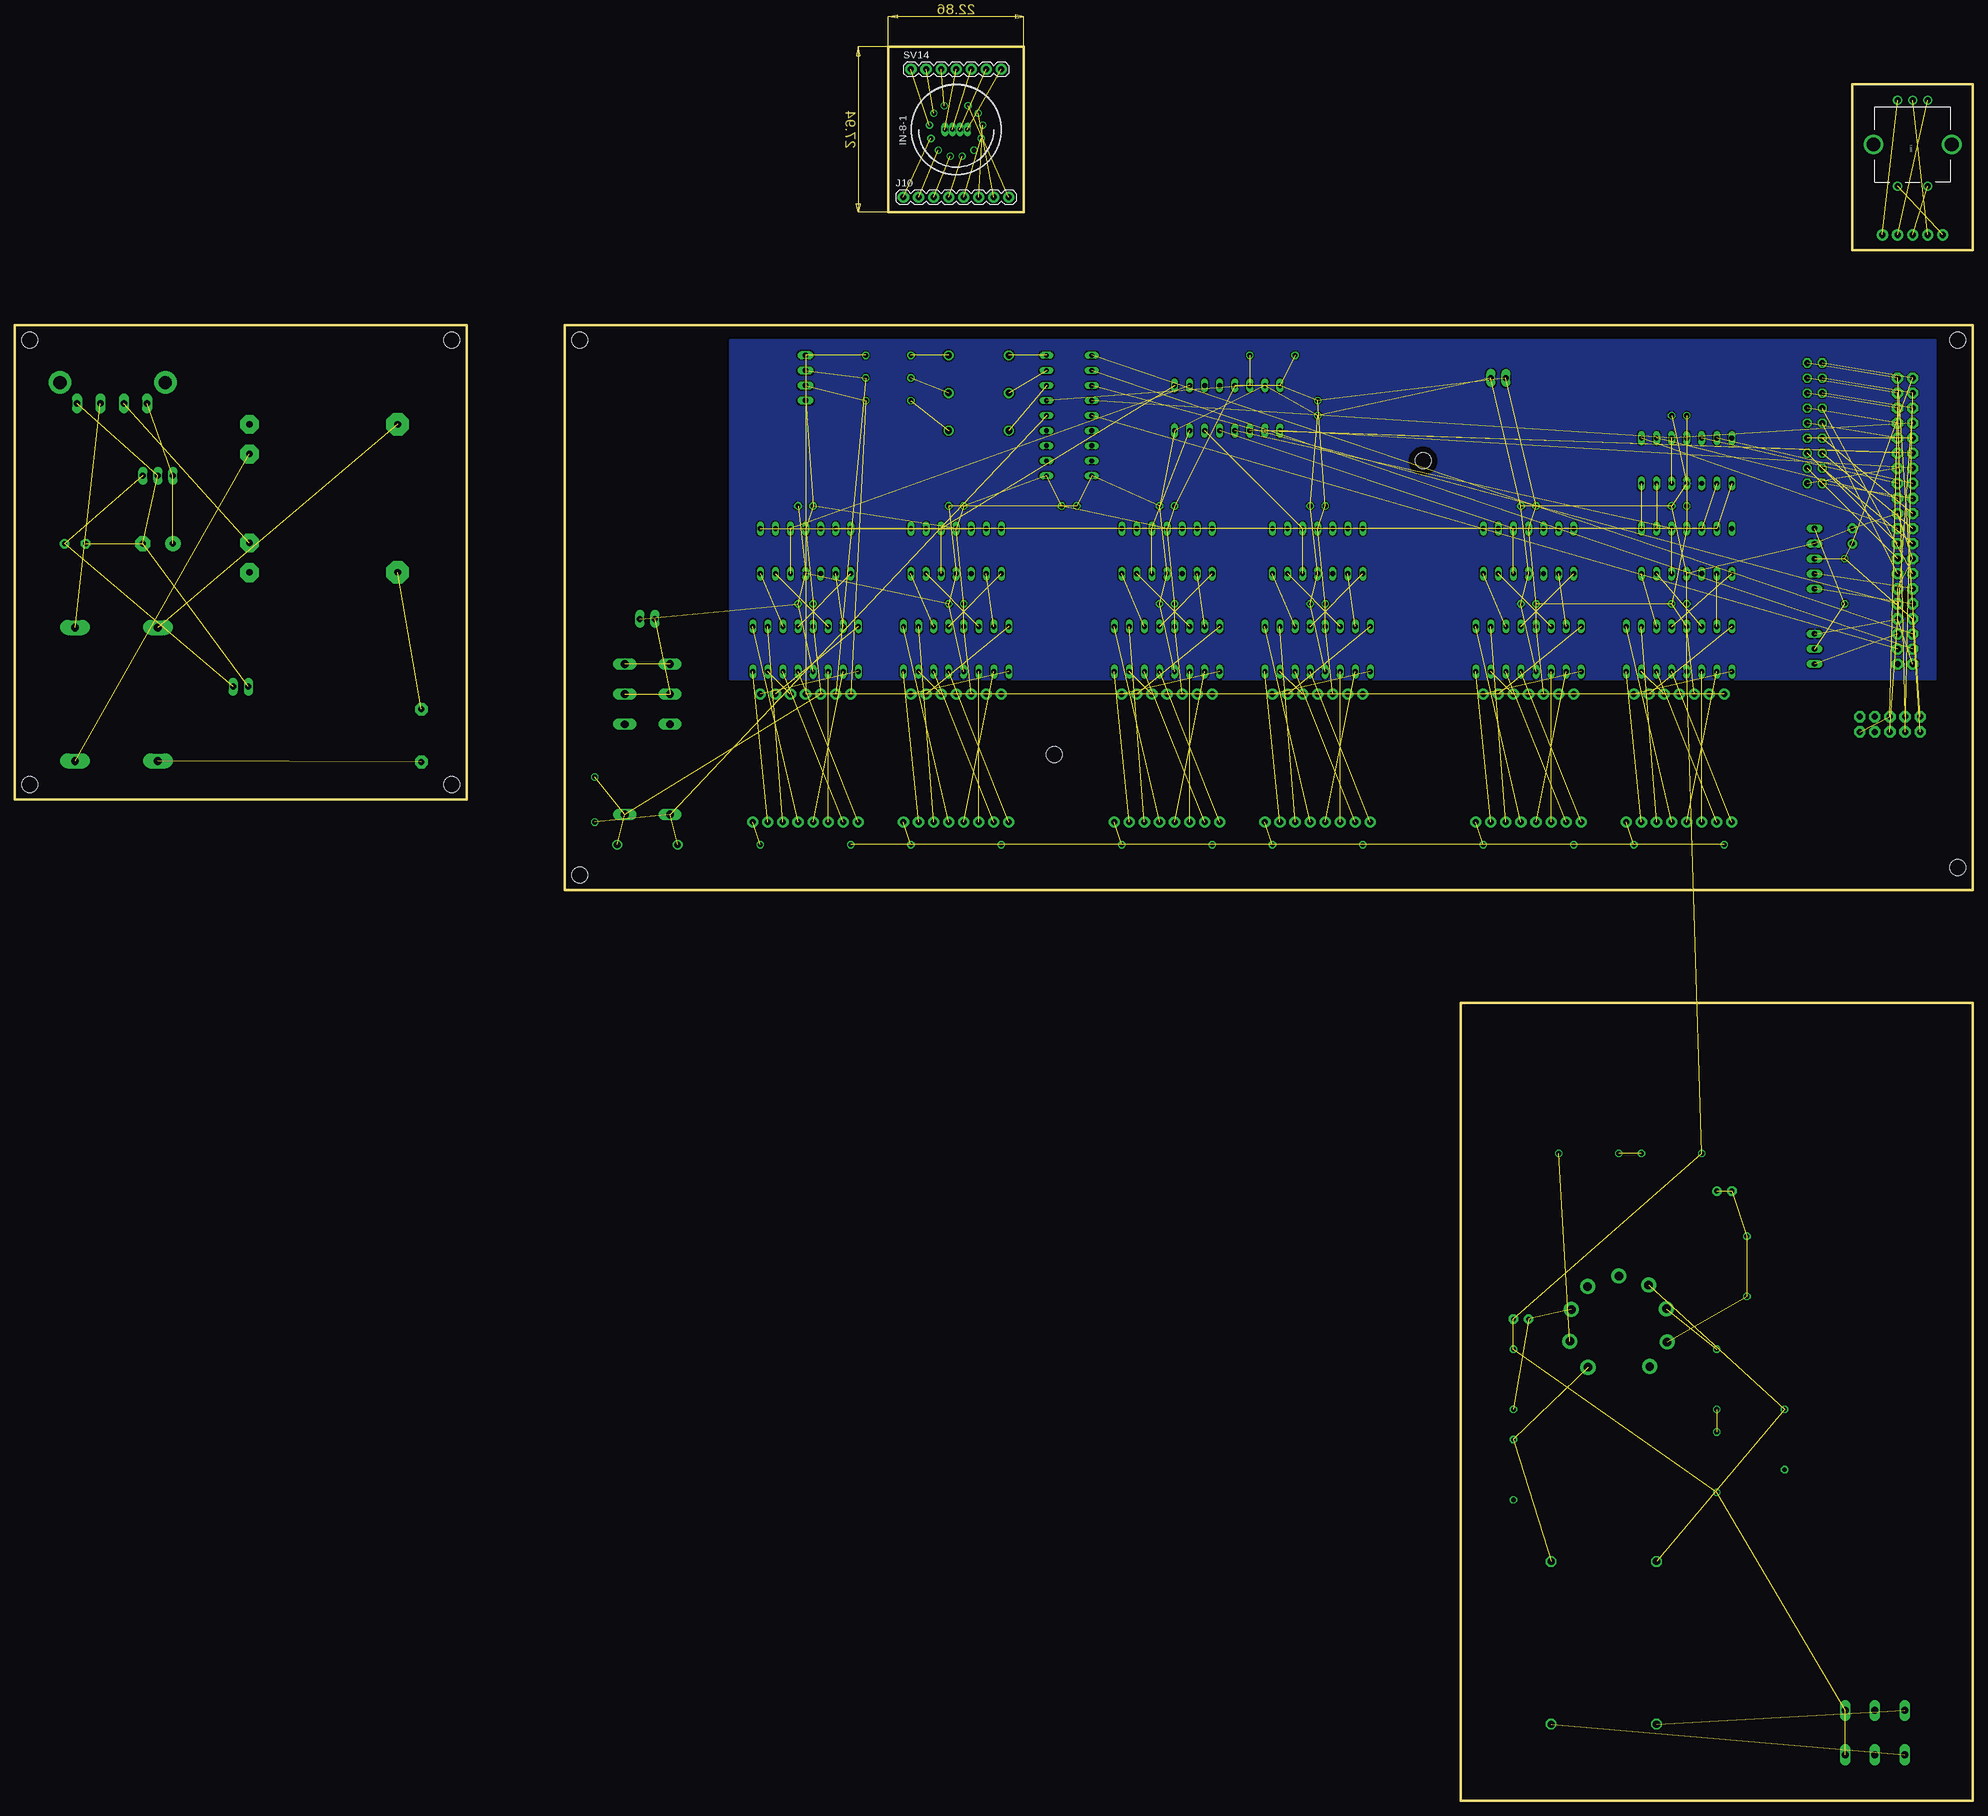
[diagram p4: board, bottom side, seen from below]

Size 330.2 x 295.91 mm. Coordinates in mm from the lower left corner, seen from the top.
Outline: 237.49,248.92 0,248.92 0,153.67 237.49,153.67 237.49,248.92
Outline: 182.88,267.97 160.02,267.97 160.02,295.91 182.88,295.91 182.88,267.97
Outline: 254,248.92 254,168.91 330.2,168.91 330.2,248.92 254,248.92
Outline: 0,289.56 20.32,289.56 20.32,261.62 0,261.62 0,289.56
Outline: 0,134.62 86.36,134.62 86.36,0 0,0 0,134.62
Copper layers (1*16): Top 0.035mm / dielectric 1.5mm / Bottom 0.035mm
Design rules "default *": minimum track width 10mil, minimum drill 24mil, track to track 8mil, track to pad 8mil, pad to pad 8mil, via to via 8mil, smd to smd 8mil, copper to edge 40mil, drill to drill 8mil, minimum pad ring 0mil, minimum via ring 8mil, stop-mask expansion 4mil, vias tented up to drill 0mil, thermal gap 10mil
Holes 2.75 mm at 234.95,246.38 2.54,157.48 92.71,226.06 154.94,176.53 2.54,246.38 327.66,246.38 327.66,171.45 256.54,171.45 256.54,246.38 234.95,156.21

### Footprints (pad centres in the part's own frame; a part is rotated, then mirrored left to right if it is on the bottom)
FBP1,5 = drill 1.118 long: + 5.811,-0.77; - -6,-0.77; AC1 1.874,-0.77; AC2 -2.063,-0.77
C025-024X044 = drill 0.813 octagon: 1 -1.27,0; 2 1.27,0
E5-10,5 = drill 1.016 pad 2.54: + -2.54,0 | drill 1.016 pad 2.54 octagon: - 2.54,0
E3,5-10 = drill 0.813 pad 1.6: + -1.778,0 | drill 0.813 pad 1.6 octagon: - 1.778,0
E2,5-5 = drill 0.813 pad 1.6: + -1.27,0 | drill 0.813 pad 1.6 octagon: - 1.27,0
C275-154X316 = drill 1.194 octagon: 1 -13.716,0; 2 13.716,0
LED-RGB-THRU = drill 0.762 pad 0.889 long: 1 1.905,0; 2 0.635,0; 3 -0.635,0; 4 -1.905,0
DO41-10 = drill 1.118: A 5.08,0; C -5.08,0
SH22,5A = drill 1.321 pad 2.54 long: 1 -11.252,0; 2 11.252,0
DIL16 = drill 0.813 long: 1 -8.89,-3.81; 2 -6.35,-3.81; 3 -3.81,-3.81; 4 -1.27,-3.81; 5 1.27,-3.81; 6 3.81,-3.81; 7 6.35,-3.81; 8 8.89,-3.81; 9 8.89,3.81; 10 6.35,3.81; 11 3.81,3.81; 12 1.27,3.81; 13 -1.27,3.81; 14 -3.81,3.81; 15 -6.35,3.81; 16 -8.89,3.81
DIL14 = drill 0.813 long: 1 -7.62,-3.81; 2 -5.08,-3.81; 3 -2.54,-3.81; 4 0,-3.81; 5 2.54,-3.81; 6 5.08,-3.81; 7 7.62,-3.81; 8 7.62,3.81; 9 5.08,3.81; 10 2.54,3.81; 11 0,3.81; 12 -2.54,3.81; 13 -5.08,3.81; 14 -7.62,3.81
78XXS = drill 1.016 long: GND 0,-2.54; IN -2.54,-2.54; OUT 2.54,-2.54
IN-8-2 = drill 0.8: 0 -3.75,-2.75; 1 2,-4; 2 3.75,-2.75; 3 4.5,-0.75; 4 4.25,1.5; 5 3,3.5; 6 1,4.5; 7 -1,4.5; 8 -4.25,1.5; 9 -4.5,-0.75; . -3,3.5; A -2,-4
2X20-SHROUDED = drill 1.016 pad 1.88 octagon: 1 -1.27,24.13; 2 1.27,24.13; 3 -1.27,21.59; 4 1.27,21.59; 5 -1.27,19.05; 6 1.27,19.05; 7 -1.27,16.51; 8 1.27,16.51; 9 -1.27,13.97; 10 1.27,13.97; 11 -1.27,11.43; 12 1.27,11.43; 13 -1.27,8.89; 14 1.27,8.89; 15 -1.27,6.35; 16 1.27,6.35; 17 -1.27,3.81; 18 1.27,3.81; 19 -1.27,1.27; 20 1.27,1.27; 21 -1.27,-1.27; 22 1.27,-1.27; 23 -1.27,-3.81; 24 1.27,-3.81; 25 -1.27,-6.35; 26 1.27,-6.35; 27 -1.27,-8.89; 28 1.27,-8.89; 29 -1.27,-11.43; 30 1.27,-11.43; 31 -1.27,-13.97; 32 1.27,-13.97; 33 -1.27,-16.51; 34 1.27,-16.51; 35 -1.27,-19.05; 36 1.27,-19.05; 37 -1.27,-21.59; 38 1.27,-21.59; 39 -1.27,-24.13; 40 1.27,-24.13
6410-02 = drill 1.016 long: 1 1.27,0; 2 -1.27,0
AVR_ICSP = drill 1.016 pad 1.88 octagon: 1 -1.27,5.08; 2 1.27,5.08; 3 -1.27,2.54; 4 1.27,2.54; 5 -1.27,0; 6 1.27,0; 7 -1.27,-2.54; 8 1.27,-2.54; 9 -1.27,-5.08; 10 1.27,-5.08
04P = drill 0.914 long: 1 -3.81,0; 2 -1.27,0; 3 1.27,0; 4 3.81,0
1X08_ROUND = drill 1.016 pad 1.88: 1 0,0; 2 2.54,0; 3 5.08,0; 4 7.62,0; 5 10.16,0; 6 12.7,0; 7 15.24,0; 8 17.78,0
03P = drill 0.914 long: 1 -2.54,0; 2 0,0; 3 2.54,0
F4052 = drill 1.321 long: 1 -3.81,3.81; 2 -3.81,-3.81; O1 11.43,-3.81; O2 11.43,3.81; P1 16.51,-3.81; P2 16.51,3.81; S1 21.59,-3.81; S2 21.59,3.81
FK218 = drill 2.21 pad 3.81: A2,2 -8.89,-0.508; B2,2 8.89,-0.508
LSP10 = drill 1.016 pad 2.159 octagon: MP 0,0
0207/15 = drill 0.813 octagon: 1 -7.62,0; 2 7.62,0
0204/7 = drill 0.813 octagon: 1 -3.81,0; 2 3.81,0
0309/10 = drill 0.813 octagon: 1 -5.08,0; 2 5.08,0
PC16D = drill 1.2 long: 1A -5,6.5; 1E 5,6.5; 1S 0,6.5; 2A -5,14; 2E 5,14; 2S 0,14
1X07 = drill 1.016 pad 1.88: 1 0,0; 2 2.54,0; 3 5.08,0; 4 7.62,0; 5 10.16,0; 6 12.7,0; 7 15.24,0
1X05 = drill 1.016 pad 1.88: 1 0,0; 2 2.54,0; 3 5.08,0; 4 7.62,0; 5 10.16,0
05P = drill 0.914 long: 1 -5.08,0; 2 -2.54,0; 3 0,0; 4 2.54,0; 5 5.08,0
MA09-2 = drill 1.016 octagon: 1 -10.16,-1.27; 2 -10.16,1.27; 3 -7.62,-1.27; 4 -7.62,1.27; 5 -5.08,-1.27; 6 -5.08,1.27; 7 -2.54,-1.27; 8 -2.54,1.27; 9 0,-1.27; 10 0,1.27; 11 2.54,-1.27; 12 2.54,1.27; 13 5.08,-1.27; 14 5.08,1.27; 15 7.62,-1.27; 16 7.62,1.27; 17 10.16,-1.27; 18 10.16,1.27
ROTARY_ENC_PLAIN = drill 1.016: A 7.493,-2.54; B 7.493,2.54; C 7.493,0; SW+ -6.985,2.54; SW- -6.985,-2.54 | drill 2.286: P$3 0,6.604; P$4 0,-6.604
EI42-1 = drill 1.118 pad 3.81 octagon: 1 -12.497,12.497; 5 -12.497,-12.497 | drill 1.118 pad 3.175 octagon: 6 12.497,-12.497; 7 12.497,-7.493; 9 12.497,7.493; 10 12.497,12.497
DIL18 = drill 0.813 long: 1 -10.16,-3.81; 2 -7.62,-3.81; 3 -5.08,-3.81; 4 -2.54,-3.81; 5 0,-3.81; 6 2.54,-3.81; 7 5.08,-3.81; 8 7.62,-3.81; 9 10.16,-3.81; 10 10.16,3.81; 11 7.62,3.81; 12 5.08,3.81; 13 2.54,3.81; 14 0,3.81; 15 -2.54,3.81; 16 -5.08,3.81; 17 -7.62,3.81; 18 -10.16,3.81
NOVAL = drill 1.422 pad 2.54: 1 5.207,-6.858; 2 8.254,-2.484; 3 8.004,2.893; 4 5.258,6.77; 5 0,8.524; 6 -5.004,7.024; 7 -8.004,3.02; 8 -8.127,-2.611; 9 -5.207,-6.731

### Placement (x,y rotation side)
B1  313.69,234.95 180 top
C1  49.53,201.93 0 top
C2  49.53,218.44 180 top
C3  74.93,201.93 180 top
C4  74.93,218.44 180 top
C5  110.49,201.93 180 top
C6  110.49,218.44 180 top
C7  135.89,201.93 180 top
C8  135.89,218.44 180 top
C9  171.45,201.93 180 top
C10  171.45,218.44 180 top
C11  196.85,201.93 180 top
C12  196.85,218.44 180 top
C13  110.49,234.95 90 top
C14  306.07,212.09 0 top
C15  320.04,212.09 180 top
C16  152.4,218.44 0 top
C17  49.53,233.68 180 top
C18  20.32,213.36 90 top
C19  53.34,26.67 270 top
C20  71.12,26.67 270 top
C21  76.2,81.28 0 top
C22  41.91,102.87 180 top
D1  171.45,281.94 0 top
D2  223.52,161.29 0 top
D3  167.64,243.84 0 top
D4  167.64,237.49 0 top
D5  167.64,231.14 0 top
F1  306.07,186.69 90 top
F2  320.04,186.69 90 top
IC1  49.53,194.31 180 top
IC2  48.26,210.82 180 top
IC3  74.93,194.31 180 top
IC4  74.93,210.82 180 top
IC5  110.49,194.31 180 top
IC6  110.49,210.82 180 top
IC7  135.89,194.31 180 top
IC8  135.89,210.82 180 top
IC9  171.45,194.31 180 top
IC10  171.45,210.82 180 top
IC11  196.85,194.31 180 top
IC12  196.85,210.82 180 top
IC13  125.73,234.95 0 top
IC14  306.07,226.06 0 top
IC15  48.26,226.06 180 top
IN-8-1  171.45,281.94 180 bottom
J1  11.43,215.9 0 top
J1_5V1  80.01,240.03 0 top
J1_5V2  292.1,187.96 180 top
J1_180V  223.52,199.39 0 top
J2  13.97,181.61 90 top
J3  196.85,240.03 270 top
J4  40.64,165.1 0 top
J5  66.04,165.1 0 top
J6  101.6,165.1 0 top
J7  127,165.1 0 top
J8  162.56,165.1 0 top
J9  187.96,165.1 0 top
J10  180.34,270.51 0 bottom
J11  26.67,194.31 270 top
K1  223.52,170.18 90 top
KK1  313.69,238.76 180 top
LSP1  261.62,175.26 0 top
LSP2  261.62,184.15 0 top
R1  49.53,161.29 180 top
R2  74.93,161.29 180 top
R3  110.49,161.29 180 top
R4  135.89,161.29 180 top
R5  171.45,161.29 180 top
R6  196.85,161.29 180 top
R7  118.11,243.84 180 top
R8  21.59,205.74 90 top
R9  182.88,243.84 0 top
R10  182.88,240.03 0 top
R11  182.88,236.22 0 top
R12  232.41,168.91 90 top
R13  77.47,55.88 270 top
R14  31.75,60.96 270 top
R15  64.77,109.22 0 top
R16  43.18,71.12 90 top
R17  50.8,109.22 0 top
R18  43.18,57.15 90 top
R19  77.47,71.12 270 top
R20  38.1,90.17 270 top
R22  16.51,1.27 0 top
SV2  57.15,186.69 180 top
SV4  82.55,186.69 180 top
SV6  118.11,186.69 180 top
SV8  143.51,186.69 180 top
SV10  179.07,186.69 180 top
SV12  204.47,186.69 180 top
SV14  179.07,292.1 0 bottom
SV15  5.08,264.16 0 top
SV16  26.67,209.55 270 top
SV17  26.67,232.41 270 top
SW1  10.16,279.4 90 bottom
TR1  278.13,219.71 0 top
ULN1  152.4,233.68 270 top
V1  59.69,80.01 0 top

### Tracks (layer width: path | path; a pad name or v marks a point on that pad's centre or on a via)
5V  (42 unrouted)
BLUE  (7 unrouted)
GND  (46 unrouted)
  pour Bottom: 209.55,189.23 6.35,189.23 6.35,246.38 209.55,246.38
GREEN  (7 unrouted)
N$1  (1 unrouted)
N$2  (1 unrouted)
N$3  (1 unrouted)
N$4  (1 unrouted)
N$5  (1 unrouted)
N$6  (1 unrouted)
N$7  (1 unrouted)
N$8  (1 unrouted)
N$9  (1 unrouted)
N$10  (1 unrouted)
N$11  (1 unrouted)
N$12  (1 unrouted)
N$13  (1 unrouted)
N$14  (1 unrouted)
N$15  (1 unrouted)
N$16  (2 unrouted)
N$17  (6 unrouted)
N$18  (1 unrouted)
N$19  (1 unrouted)
N$20  (1 unrouted)
N$21  (1 unrouted)
N$22  (1 unrouted)
N$23  (1 unrouted)
N$24  (1 unrouted)
N$25  (1 unrouted)
N$26  (1 unrouted)
N$27  (1 unrouted)
N$28  (1 unrouted)
N$29  (1 unrouted)
N$30  (1 unrouted)
N$31  (1 unrouted)
N$32  (1 unrouted)
N$33  (2 unrouted)
N$34  (1 unrouted)
N$35  (1 unrouted)
N$36  (1 unrouted)
N$37  (1 unrouted)
N$38  (1 unrouted)
N$39  (1 unrouted)
N$40  (1 unrouted)
N$41  (1 unrouted)
N$42  (1 unrouted)
N$43  (1 unrouted)
N$44  (1 unrouted)
N$45  (1 unrouted)
N$46  (1 unrouted)
N$47  (1 unrouted)
N$48  (2 unrouted)
N$49  (1 unrouted)
N$50  (1 unrouted)
N$51  (1 unrouted)
N$52  (1 unrouted)
N$53  (1 unrouted)
N$54  (1 unrouted)
N$55  (1 unrouted)
N$56  (1 unrouted)
N$57  (1 unrouted)
N$58  (1 unrouted)
N$59  (1 unrouted)
N$60  (1 unrouted)
N$61  (1 unrouted)
N$62  (1 unrouted)
N$63  (2 unrouted)
N$64  (1 unrouted)
N$65  (1 unrouted)
N$66  (1 unrouted)
N$67  (1 unrouted)
N$68  (1 unrouted)
N$69  (1 unrouted)
N$70  (1 unrouted)
N$71  (1 unrouted)
N$72  (1 unrouted)
N$73  (1 unrouted)
N$74  (1 unrouted)
N$75  (1 unrouted)
N$76  (1 unrouted)
N$77  (1 unrouted)
N$78  (2 unrouted)
N$79  (1 unrouted)
N$80  (1 unrouted)
N$81  (1 unrouted)
N$82  (1 unrouted)
N$83  (1 unrouted)
N$84  (1 unrouted)
N$85  (1 unrouted)
N$86  (1 unrouted)
N$87  (1 unrouted)
N$88  (1 unrouted)
N$89  (1 unrouted)
N$90  (1 unrouted)
N$91  (1 unrouted)
N$92  (1 unrouted)
N$93  (2 unrouted)
N$94  (6 unrouted)
N$95  (6 unrouted)
N$96  (6 unrouted)
N$97  (1 unrouted)
N$98  (1 unrouted)
N$99  (1 unrouted)
N$100  (1 unrouted)
N$101  (1 unrouted)
N$102  (1 unrouted)
N$103  (1 unrouted)
N$104  (1 unrouted)
N$105  (1 unrouted)
N$106  (1 unrouted)
N$107  (1 unrouted)
N$108  (2 unrouted)
N$109  (1 unrouted)
N$110  (1 unrouted)
N$111  (1 unrouted)
N$112  (1 unrouted)
N$113  (1 unrouted)
N$114  (1 unrouted)
N$115  (1 unrouted)
N$116  (1 unrouted)
N$117  (1 unrouted)
N$118  (1 unrouted)
N$119  (1 unrouted)
N$120  (1 unrouted)
N$121  (1 unrouted)
N$122  (1 unrouted)
N$123  (2 unrouted)
N$124  (1 unrouted)
N$125  (4 unrouted)
N$126  (2 unrouted)
N$127  (1 unrouted)
N$128  (1 unrouted)
N$129  (1 unrouted)
N$130  (6 unrouted)
N$131  (1 unrouted)
N$132  (1 unrouted)
N$133  (1 unrouted)
N$134  (1 unrouted)
N$135  (1 unrouted)
N$136  (1 unrouted)
N$137  (1 unrouted)
N$138  (1 unrouted)
N$139  (1 unrouted)
N$140  (2 unrouted)
N$141  (1 unrouted)
N$142  (1 unrouted)
N$143  (1 unrouted)
N$144  (1 unrouted)
N$146  (3 unrouted)
N$147  (1 unrouted)
N$148  (1 unrouted)
N$149  (1 unrouted)
N$150  (1 unrouted)
N$151  (3 unrouted)
N$152  (1 unrouted)
N$153  (2 unrouted)
N$154  (2 unrouted)
N$155  (2 unrouted)
N$156  (3 unrouted)
N$157  (1 unrouted)
N$158  (1 unrouted)
N$159  (1 unrouted)
N$160  (1 unrouted)
N$161  (1 unrouted)
N$162  (1 unrouted)
N$163  (1 unrouted)
N$164  (1 unrouted)
N$165  (1 unrouted)
N$166  (1 unrouted)
N$167  (1 unrouted)
N$168  (1 unrouted)
N$169  (1 unrouted)
N$170  (5 unrouted)
N$171  (1 unrouted)
N$172  (2 unrouted)
N$173  (1 unrouted)
N$174  (1 unrouted)
N$175  (1 unrouted)
N$176  (1 unrouted)
N$177  (2 unrouted)
N$178  (2 unrouted)
N$179  (1 unrouted)
N$180  (4 unrouted)
N$181  (2 unrouted)
N$182  (2 unrouted)
N$184  (1 unrouted)
N$185  (1 unrouted)
RED  (7 unrouted)
VCC  (1 unrouted)

### Text on the board
tPlace: RTC With BAT
tNames: RED | 3.3V | 5V | GREEN | SDA | 5V | BLUE | SCL | GND | GND | 5V | ID_SD | TX | ID_SC | RX | MOSI | GND | MISO | CE0 | SCLK | CE1 | 3.3V | GND | VCC | GND | SW | SIB | SIA | GND | VCC | PIR